# Altium schematic sheet DAQ and Actuators.SchDoc
size A3
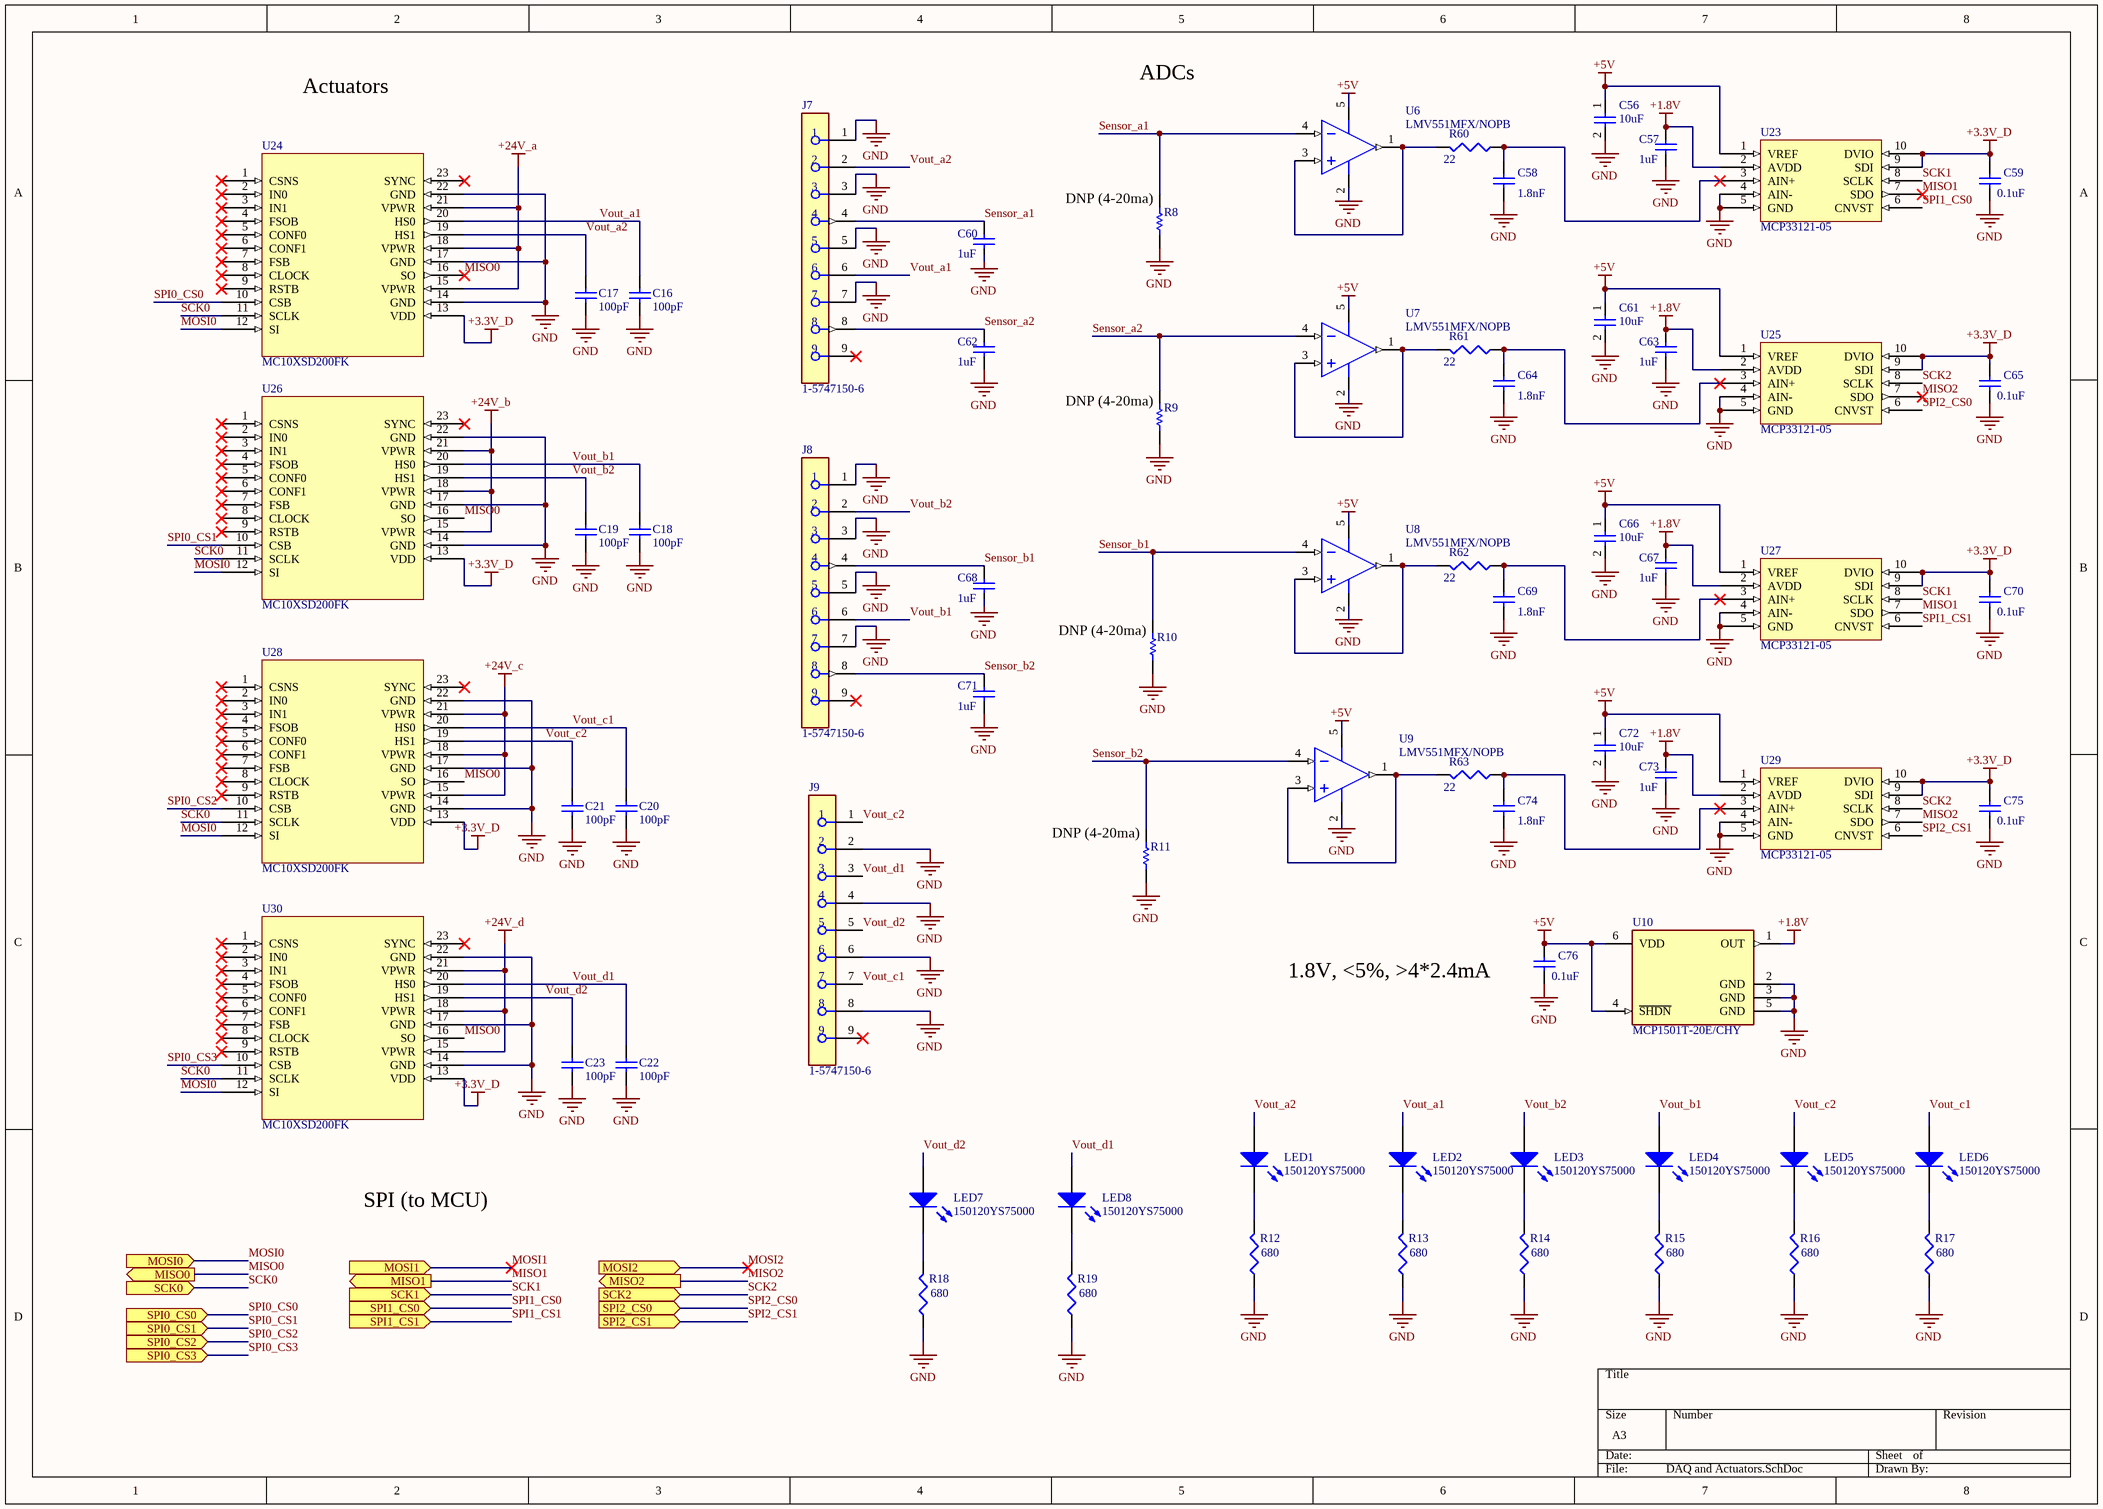
[diagram p0: DAQ and Actuators.SchDoc]

## Parts
C16  value 100pF  [CAPC1608X95X40LL15T15]  (hidden comment: Cap)
C17  value 100pF  [CAPC1608X95X40LL15T15]  (hidden comment: Cap)
C18  value 100pF  [CAPC1608X95X40LL15T15]  (hidden comment: Cap)
C19  value 100pF  [CAPC1608X95X40LL15T15]  (hidden comment: Cap)
C20  value 100pF  [CAPC1608X95X40LL15T15]  (hidden comment: Cap)
C21  value 100pF  [CAPC1608X95X40LL15T15]  (hidden comment: Cap)
C22  value 100pF  [CAPC1608X95X40LL15T15]  (hidden comment: Cap)
C23  value 100pF  [CAPC1608X95X40LL15T15]  (hidden comment: Cap)
C56  value 10uF  [0603 CAP POLARIZED]  (hidden comment: Cap)
C57  value 1uF  [1608[0603]]  (hidden comment: Cap)
C58  value 1.8nF  [1608[0603]]  (hidden comment: Cap)
C59  value 0.1uF  [1608[0603]]  (hidden comment: Cap)
C60  value 1uF  [1608[0603]]  (hidden comment: Cap)
C61  value 10uF  [0603 CAP POLARIZED]  (hidden comment: Cap)
C62  value 1uF  [1608[0603]]  (hidden comment: Cap)
C63  value 1uF  [1608[0603]]  (hidden comment: Cap)
C64  value 1.8nF  [1608[0603]]  (hidden comment: Cap)
C65  value 0.1uF  [1608[0603]]  (hidden comment: Cap)
C66  value 10uF  [0603 CAP POLARIZED]  (hidden comment: Cap)
C67  value 1uF  [1608[0603]]  (hidden comment: Cap)
C68  value 1uF  [1608[0603]]  (hidden comment: Cap)
C69  value 1.8nF  [1608[0603]]  (hidden comment: Cap)
C70  value 0.1uF  [1608[0603]]  (hidden comment: Cap)
C71  value 1uF  [1608[0603]]  (hidden comment: Cap)
C72  value 10uF  [0603 CAP POLARIZED]  (hidden comment: Cap)
C73  value 1uF  [1608[0603]]  (hidden comment: Cap)
C74  value 1.8nF  [1608[0603]]  (hidden comment: Cap)
C75  value 0.1uF  [1608[0603]]  (hidden comment: Cap)
C76  value 0.1uF  [1608[0603]]  (hidden comment: Cap)
J7  1-5747150-6  [FP-1-5747150-6-MFG]
J8  1-5747150-6  [FP-1-5747150-6-MFG]
J9  1-5747150-6  [FP-1-5747150-6-MFG]
LED1  150120YS75000  [1206_A]
LED2  150120YS75000  [1206_A]
LED3  150120YS75000  [1206_A]
LED4  150120YS75000  [1206_A]
LED5  150120YS75000  [1206_A]
LED6  150120YS75000  [1206_A]
LED7  150120YS75000  [1206_A]
LED8  150120YS75000  [1206_A]
R8  ERA-3AED2490V  [RESC1608X55X30LL20T20]  (value not drawn)
R9  ERA-3AED2490V  [RESC1608X55X30LL20T20]  (value not drawn)
R10  ERA-3AED2490V  [RESC1608X55X30LL20T20]  (value not drawn)
R11  ERA-3AED2490V  [RESC1608X55X30LL20T20]  (value not drawn)
R12  value 680  [J1-0603]  (hidden comment: Res3)
R13  value 680  [J1-0603]  (hidden comment: Res3)
R14  value 680  [J1-0603]  (hidden comment: Res3)
R15  value 680  [J1-0603]  (hidden comment: Res3)
R16  value 680  [J1-0603]  (hidden comment: Res3)
R17  value 680  [J1-0603]  (hidden comment: Res3)
R18  value 680  [J1-0603]  (hidden comment: Res3)
R19  value 680  [J1-0603]  (hidden comment: Res3)
R60  value 22  [J1-0603]  (hidden comment: Res3)
R61  value 22  [J1-0603]  (hidden comment: Res3)
R62  value 22  [J1-0603]  (hidden comment: Res3)
R63  value 22  [J1-0603]  (hidden comment: Res3)
U6  LMV551MFX/NOPB  [DBV0005A_L]
U7  LMV551MFX/NOPB  [DBV0005A_L]
U8  LMV551MFX/NOPB  [DBV0005A_L]
U9  LMV551MFX/NOPB  [DBV0005A_L]
U10  MCP1501T-20E/CHY  [FP-C04-028-CHY-MFG]
U23  MCP33121-05  [MCP33121-05]
U24  MC10XSD200FK  [PQFN50P1200X1200X220_HS-33N]
U25  MCP33121-05  [MCP33121-05]
U26  MC10XSD200FK  [PQFN50P1200X1200X220_HS-33N]
U27  MCP33121-05  [MCP33121-05]
U28  MC10XSD200FK  [PQFN50P1200X1200X220_HS-33N]
U29  MCP33121-05  [MCP33121-05]
U30  MC10XSD200FK  [PQFN50P1200X1200X220_HS-33N]

## Ports
MISO0 (out), MISO1 (out), MISO2 (out), MOSI0 (in), MOSI1 (in), MOSI2 (in), SCK0 (in), SCK1 (in), SCK2 (in), SPI0_CS0 (in), SPI0_CS1 (in), SPI0_CS2 (in), SPI0_CS3 (in), SPI1_CS0 (in), SPI1_CS1 (in), SPI2_CS0 (in), SPI2_CS1 (in)

## Nets
+1.8V: C57.2 C63.2 C67.2 C73.2 U10.1(OUT) U23.2(AVDD) U25.2(AVDD) U27.2(AVDD) U29.2(AVDD)
+3.3V_D: C59.2 C65.2 C70.2 C75.2 U23.9(SDI) U23.10(DVIO) U24.13(VDD) U25.9(SDI) U25.10(DVIO) U26.13(VDD) U27.9(SDI) U27.10(DVIO) U28.13(VDD) U29.9(SDI) U29.10(DVIO) U30.13(VDD)
+5V: C56.1 C61.1 C66.1 C72.1 C76.2 U6.5(V+) U7.5(V+) U8.5(V+) U9.5(V+) U10.4(~{SHDN}) U10.6(VDD) U23.1(VREF) U25.1(VREF) U27.1(VREF) U29.1(VREF)
+24V_a: U24.15(VPWR) U24.18(VPWR) U24.21(VPWR)
+24V_b: U26.15(VPWR) U26.18(VPWR) U26.21(VPWR)
+24V_c: U28.15(VPWR) U28.18(VPWR) U28.21(VPWR)
+24V_d: U30.15(VPWR) U30.18(VPWR) U30.21(VPWR)
GND: C16.1 C17.1 C18.1 C19.1 C20.1 C21.1 C22.1 C23.1 C56.2 C57.1 C58.1 C59.1 C60.1 C61.2 C62.1 C63.1 C64.1 C65.1 C66.2 C67.1 C68.1 C69.1 C70.1 C71.1 C72.2 C73.1 C74.1 C75.1 C76.1 J7.1 J7.3 J7.5 J7.7 J8.1 J8.3 J8.5 J8.7 J9.2 J9.4 J9.6 J9.8 R8.1 R9.1 R10.1 R11.1 R12.1 R13.1 R14.1 R15.1 R16.1 R17.1 R18.1 R19.1 U6.2(V-) U7.2(V-) U8.2(V-) U9.2(V-) U10.2(GND) U10.3(GND) U10.5(GND) U23.4(AIN-) U23.5(GND) U24.14(GND) U24.17(GND) U24.22(GND) U25.4(AIN-) U25.5(GND) U26.14(GND) U26.17(GND) U26.22(GND) U27.4(AIN-) U27.5(GND) U28.14(GND) U28.17(GND) U28.22(GND) U29.4(AIN-) U29.5(GND) U30.14(GND) U30.17(GND) U30.22(GND)
MISO0: U24.16(SO) U26.16(SO) U28.16(SO) U30.16(SO) ; port MISO0
MISO1: U23.7(SDO) U27.7(SDO) ; port MISO1
MISO2: U25.7(SDO) U29.7(SDO) ; port MISO2
MOSI0: U24.12(SI) U26.12(SI) U28.12(SI) U30.12(SI) ; port MOSI0
MOSI1: port MOSI1
MOSI2: port MOSI2
SCK0: U24.11(SCLK) U26.11(SCLK) U28.11(SCLK) U30.11(SCLK) ; port SCK0
SCK1: U23.8(SCLK) U27.8(SCLK) ; port SCK1
SCK2: U25.8(SCLK) U29.8(SCLK) ; port SCK2
Sensor_a1: C60.2 J7.4 R8.2 U6.4(IN-)
Sensor_a2: C62.2 J7.8 R9.2 U7.4(IN-)
Sensor_b1: C68.2 J8.4 R10.2 U8.4(IN-)
Sensor_b2: C71.2 J8.8 R11.2 U9.4(IN-)
SPI0_CS0: U24.10(CSB) ; port SPI0_CS0
SPI0_CS1: U26.10(CSB) ; port SPI0_CS1
SPI0_CS2: U28.10(CSB) ; port SPI0_CS2
SPI0_CS3: U30.10(CSB) ; port SPI0_CS3
SPI1_CS0: U23.6(CNVST) ; port SPI1_CS0
SPI1_CS1: U27.6(CNVST) ; port SPI1_CS1
SPI2_CS0: U25.6(CNVST) ; port SPI2_CS0
SPI2_CS1: U29.6(CNVST) ; port SPI2_CS1
Vout_a1: C16.2 J7.6 LED2.2(A) U24.20(HS0)
Vout_a2: C17.2 J7.2 LED1.2(A) U24.19(HS1)
Vout_b1: C18.2 J8.6 LED4.2(A) U26.20(HS0)
Vout_b2: C19.2 J8.2 LED3.2(A) U26.19(HS1)
Vout_c1: C20.2 J9.7 LED6.2(A) U28.20(HS0)
Vout_c2: C21.2 J9.1 LED5.2(A) U28.19(HS1)
Vout_d1: C22.2 J9.3 LED8.2(A) U30.20(HS0)
Vout_d2: C23.2 J9.5 LED7.2(A) U30.19(HS1)
NetC58_2: C58.2 R60.1 U23.3(AIN+)
NetC64_2: C64.2 R61.1 U25.3(AIN+)
NetC69_2: C69.2 R62.1 U27.3(AIN+)
NetC74_2: C74.2 R63.1 U29.3(AIN+)
NetLED1_1: LED1.1(K) R12.2
NetLED2_1: LED2.1(K) R13.2
NetLED3_1: LED3.1(K) R14.2
NetLED4_1: LED4.1(K) R15.2
NetLED5_1: LED5.1(K) R16.2
NetLED6_1: LED6.1(K) R17.2
NetLED7_1: LED7.1(K) R18.2
NetLED8_1: LED8.1(K) R19.2
NetR60_2: R60.2 U6.1(OUT) U6.3(IN+)
NetR61_2: R61.2 U7.1(OUT) U7.3(IN+)
NetR62_2: R62.2 U8.1(OUT) U8.3(IN+)
NetR63_2: R63.2 U9.1(OUT) U9.3(IN+)

Not connected (* = marked no-connect by the designer): J7 9*; J8 9*; J9 9*; U24 1(CSNS)* 2(IN0)* 3(IN1)* 4(FSOB)* 5(CONF0)* 6(CONF1)* 7(FSB)* 8(CLOCK)* 9(RSTB)* 23(SYNC)*; U26 1(CSNS)* 2(IN0)* 3(IN1)* 4(FSOB)* 5(CONF0)* 6(CONF1)* 7(FSB)* 8(CLOCK)* 9(RSTB)* 23(SYNC)*; U28 1(CSNS)* 2(IN0)* 3(IN1)* 4(FSOB)* 5(CONF0)* 6(CONF1)* 7(FSB)* 8(CLOCK)* 9(RSTB)* 23(SYNC)*; U30 1(CSNS)* 2(IN0)* 3(IN1)* 4(FSOB)* 5(CONF0)* 6(CONF1)* 7(FSB)* 8(CLOCK)* 9(RSTB)* 23(SYNC)*

## Notes on the sheet
- Actuators
- ADCs
- (near R8) DNP (4-20ma)
- (near R9) DNP (4-20ma)
- (near R10) DNP (4-20ma)
- (near R11) DNP (4-20ma)
- (near C76) 1.8V, <5%, >4*2.4mA
- SPI (to MCU)

## Library data of the parts
C16-C23 = Cap: MULTICOMP - MC0603F223Z500CT - KONDENSATOR, 0.022µF, 50V, Y5V, 0603; Tolerance: -20%; Capacitance: 22nF; Published: 8-Jun-2000; LatestRevisionDate: 17-Jul-2002; LatestRevisionNote: Re-released for DXP Platform.; PackageReference: RAD-0.3; Publisher: Altium Limited; PackageDescription: Radial Cap, Thru-Hole; 2 Leads; 0.3 in Pin Spacing; Manufacturer: Multicomp; Manufacturer Part Number: MC0603F223Z500CT; RoHS: Yes; Category: Capacitors; Stock 1: 9682; Pricing 1: 10=0.01100, 25=0.01100, 100=0.01100, 250=0.01100, 500=0.01100, 1000=0.01100 (CAD); Case/Package: 0603; Case Code (Metric): 1608; Case Code (Imperial): 0603; Min Operating Temperature: -30°C; Max Operating Temperature: 85°C; Packaging: Cut Tape; Voltage Rating (DC): 50V; Dielectric: Y5V; Voltage Rating: 50V; REACH SVHC: Unknown; ComponentLink1URL: https://datasheet.ciiva.com/46443/1870456-46443401.pdf?src-supplier=Element14; ComponentLink1Description: https://datasheet.ciiva.com/46443/1870456-46443401.pdf?src-supplier=Element14; ComponentLink2URL: https://datasheet.ciiva.com/46443/1870456-46443402.pdf?src-supplier=Element14; ComponentLink2Description: https://datasheet.ciiva.com/46443/1870456-46443402.pdf?src-supplier=Element14; Supplier 1: Digi-Key; Supplier Part Number 1: 720-1526-1-ND
C56 C61 C66 C72 = Cap: 10µF Molded Tantalum Capacitors 10V 0603 (1608 Metric) 7.5Ohm @ 100kHz; Published: 8-Jun-2000; LatestRevisionDate: 17-Jul-2002; LatestRevisionNote: Re-released for DXP Platform.; PackageReference: RAD-0.3; Publisher: Altium Limited; PackageDescription: Radial Cap, Thru-Hole; 2 Leads; 0.3 in Pin Spacing; Supplier 1: Digi-Key; Supplier Part Number 1: 478-F981A106MMUAJ6CT-ND
C57 C60 C62 C63 C67 C68 C71 C73 = Cap: 1µF ±10% 10V Ceramic Capacitor X7R 0603 (1608 Metric); Published: 8-Jun-2000; LatestRevisionDate: 17-Jul-2002; LatestRevisionNote: Re-released for DXP Platform.; PackageReference: RAD-0.3; Publisher: Altium Limited; PackageDescription: Radial Cap, Thru-Hole; 2 Leads; 0.3 in Pin Spacing; Supplier 1: Digi-Key; Supplier Part Number 1: 587-1242-1-ND
C58 C64 C69 C74 = Cap: 1800pF ±10% 50V Ceramic Capacitor X7R 0603 (1608 Metric); Published: 8-Jun-2000; LatestRevisionDate: 17-Jul-2002; LatestRevisionNote: Re-released for DXP Platform.; PackageReference: RAD-0.3; Publisher: Altium Limited; PackageDescription: Radial Cap, Thru-Hole; 2 Leads; 0.3 in Pin Spacing; Supplier 1: Digi-Key; Supplier Part Number 1: 399-7867-1-ND
C59 C65 C70 C75 C76 = Cap: 0.1µF ±10% 25V Ceramic Capacitor X7R 0603 (1608 Metric); Published: 8-Jun-2000; LatestRevisionDate: 17-Jul-2002; LatestRevisionNote: Re-released for DXP Platform.; PackageReference: RAD-0.3; Publisher: Altium Limited; PackageDescription: Radial Cap, Thru-Hole; 2 Leads; 0.3 in Pin Spacing; Supplier 1: Digi-Key; Supplier Part Number 1: 478-3714-1-ND
J7-J9 = CMP-03367-000009-1: CONN D-SUB RCPT 9POS VERT SOLDER; Manufacturer: TE Connectivity; Is Female: yes; Current Rating: 6A; Conn Orientation: Vertical; Conn Gender: Female; Shielding: false; Number Of Contacts: 9; Pitch: 2.74mm; ComponentLink2URL: https://www.te.com/usa-en/product-1-5747150-6.html?te_bu=Cor&te_type=other&te_campaign=oct_glo_cor-oct-global-oth-prtnr-fy19-oct-octo-buy-bom_sma-298_2&elqCampaignId=35216; Manufacturer Part Number: 1-5747150-6; Temperature: -55°C to +105°C; Mouser Description: D-Sub Standard Connectors RECP FRNT MTL SHL 9P female screwlocks; Octopart: https://octopart.com/1-5747150-6-te+connectivity-39500344; Category: Conn; Automotive: No; Package: 1-5747150-6; Device Class L3: unset; Contact Material: Gold,Nickel; Lead Free: Yes; Height: 12.54mm; RoHS: TRUE; ComponentLink2Description: Datasheet; Device Class L2: D-Sub Connectors; Device Class L1: Connectors; Digikey Description: CONN D-SUB RCPT 9POS VERT SOLDER; Temperature Range High: +105°C; Temperature Range Low: -55°C
LED1-LED8 = CMP-1426-00019-1: SMD mono-color Chip LED, WL-SMCW, Yellow; Manufacturer: Wuerth Elektronik; ComponentLink2URL: http://katalog.we-online.com/led/datasheet/150120YS75000.pdf; PartNumber: 150120YS75000; ComponentLink1URL: http://www.we-online.com; Color: Yellow; ComponentLink1Description: Manufacturer URL; PackageReference: 1206_A; ComponentLink2Description: Datasheet
R8-R11 = CMP-2000-00150-1: Manufacturer: Panasonic; Part Number: ERA-3AED2490V
R12-R19 = Res3: Resistor; Published: 8-Jun-2000; LatestRevisionDate: 29-May-2009; LatestRevisionNote: IPC-7351 Footprint Added.; PackageReference: J1-0603; Publisher: Altium Limited; PackageDescription: Chip Resistor; Supplier 1: Digi-Key; Supplier Part Number 1: 1292-WR06X6800FTLCT-ND
R60-R63 = Res3: 22 Ohms ±0.1% 0.1W, 1/10W Chip Resistor 0603 (1608 Metric)  Thin Film; Published: 8-Jun-2000; LatestRevisionDate: 29-May-2009; LatestRevisionNote: IPC-7351 Footprint Added.; PackageReference: J1-0603; Publisher: Altium Limited; PackageDescription: Chip Resistor; Supplier 1: Digi-Key; Supplier Part Number 1: 13-RT0603BRD0722RLCT-ND
U6-U9 = CMP-0055-01011-3: 3 MHz, Micropower RRO Amplifier, 5-pin SOT-23, Pb-Free; Manufacturer: Texas Instruments; PowerWise: N; PackageTopMarking: AF3A*XTT; CompType: Amplifiers; RoHS: Y; PinCount: 5; ComponentLink1Description: Datasheet URL; Package Reference: DBV0005A; PackageDescription: Molded SOT-23, .115 x .063 x .040 in Body, 5 Lead, .0375 in Pitch; ComponentLink1URL: http://www.ti.com/general/docs/lit/getliterature.tsp?genericPartNumber=LMV551&fileType=pdf
U10 = CMP-06323-000004-1: IC VREF SERIES 0.1% SOT23-6; Manufacturer: Microchip; Output Current: 20mA; Number Of Outputs: 1; Output Type: Fixed; Max Supply Voltage: 5.5V; Standoff Height: 0mm; Min Supply Voltage: 2.25V; Output Voltage: 2.048V; Nominal Supply Current: 140uA; Reference Type: Series; ComponentLink2Description: Datasheet; Height: 1.45mm; Manufacturer Part Number: MCP1501T-20E/CHY; ComponentLink2URL: http://ww1.microchip.com/downloads/en/DeviceDoc/20005474E.pdf; Digikey Description: IC VREF SERIES 0.1% SOT23-6; Device Class L2: Power Management ICs; Temperature: -40°C to +125°C; Lead Free: Yes; Ambient Temperature Range Low: -40°C; RoHS: TRUE; Temperature Range Low: -40°C; Category: IC; Ambient Temperature Range High: +125°C; Temperature Range High: +125°C; Package: C04-028-CHY; Device Class L1: Integrated Circuits (ICs); Ipc Land Pattern Name: SOT95P280X118-6; Device Class L3: Voltage References; Octopart: https://octopart.com/mcp1501t-20e%2Fchy-microchip-70491618; Footprint Url: http://ww1.microchip.com/downloads/en/DeviceDoc/6L_SOT-23_OT_OTY_C04-028C_OT.pdf; Automotive: No
U24 U26 U28 U30 = MC06XS4200: Supplier 1: Avnet; Supplier Part Number 1: MC10XSD200FK